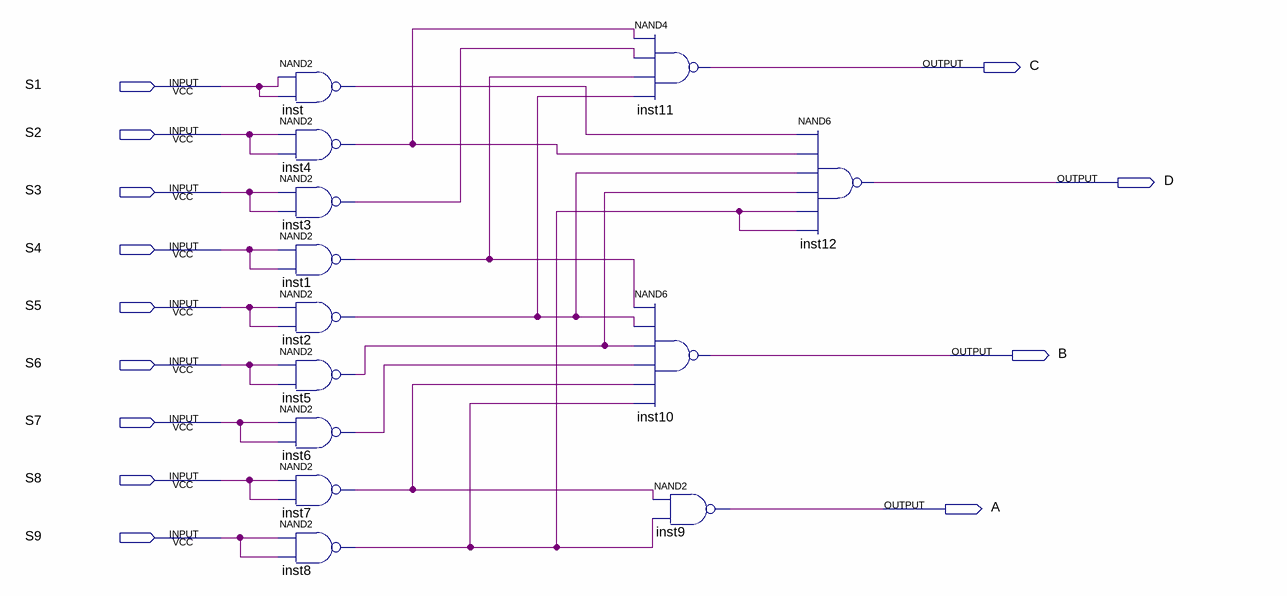
[diagram p0: schematic sheet]
// Quartus schematic coder.bdf as structural Verilog: 13 symbols, 13 pins
module coder (
  input  S1,
  input  S2,
  input  S3,
  input  S4,
  input  S5,
  input  S6,
  input  S7,
  input  S8,
  input  S9,
  output C,
  output D,
  output B,
  output A
);

  wire inst1_out, inst2_out, inst3_out, inst4_out, inst5_out, inst6_out, inst7_out, inst8_out, inst_out;

  nand inst (inst_out, S1, S1);
  nand inst4 (inst4_out, S2, S2);
  nand inst3 (inst3_out, S3, S3);
  nand inst1 (inst1_out, S4, S4);
  nand inst2 (inst2_out, S5, S5);
  nand inst5 (inst5_out, S6, S6);
  nand inst6 (inst6_out, S7, S7);
  nand inst7 (inst7_out, S8, S8);
  nand inst8 (inst8_out, S9, S9);
  nand inst11 (C, inst4_out, inst3_out, inst1_out, inst2_out);
  nand inst10 (B, inst1_out, inst2_out, inst5_out, inst6_out, inst7_out, inst8_out);
  nand inst9 (A, inst7_out, inst8_out);
  nand inst12 (D, inst_out, inst4_out, inst2_out, inst5_out, inst8_out, inst8_out);
endmodule
